# EAGLE design untitled (EAGLE 9.1.1)
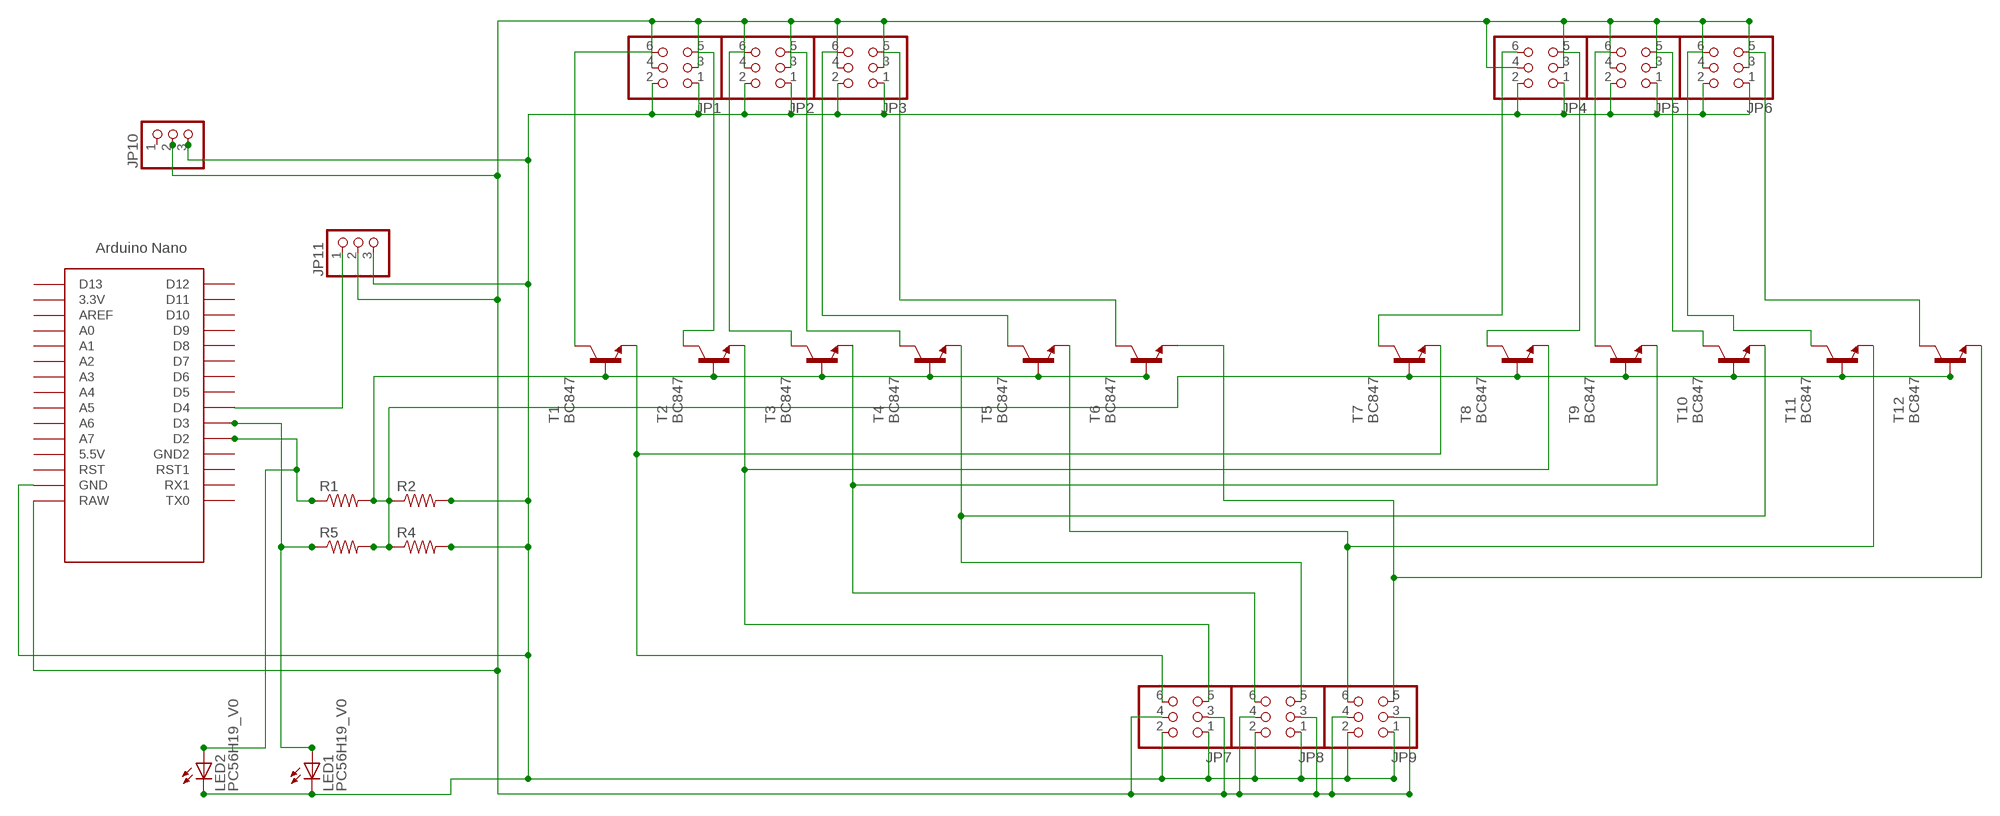
[diagram p0: schematic, sheet 1]

## Parts
JP1  PINHD-2X3  [2X03]
JP2  PINHD-2X3  [2X03]
JP3  PINHD-2X3  [2X03]
JP4  PINHD-2X3  [2X03]
JP5  PINHD-2X3  [2X03]
JP6  PINHD-2X3  [2X03]
JP7  PINHD-2X3  [2X03]
JP8  PINHD-2X3  [2X03]
JP9  PINHD-2X3  [2X03]
JP10  PINHD-1X3  [1X03]
JP11  PINHD-1X3  [1X03]
LED1  PC56H19_V0  [PC56H19_V0]
LED2  PC56H19_V0  [PC56H19_V0]
R1  R-US_0207/10  [0207/10]
R2  R-US_0207/10  [0207/10]
R4  R-US_0207/10  [0207/10]
R5  R-US_0207/10  [0207/10]
T1  BC847  [SOT23]
T2  BC847  [SOT23]
T3  BC847  [SOT23]
T4  BC847  [SOT23]
T5  BC847  [SOT23]
T6  BC847  [SOT23]
T7  BC847  [SOT23]
T8  BC847  [SOT23]
T9  BC847  [SOT23]
T10  BC847  [SOT23]
T11  BC847  [SOT23]
T12  BC847  [SOT23]
U$1  NANO  [NANO]

## Nets
N$1: JP1.6 T1.3(C)
N$2: JP1.5 T2.3(C)
N$3: JP2.6 T3.3(C)
N$4: JP2.5 T4.3(C)
N$5: JP3.6 T5.3(C)
N$6: JP3.5 T6.3(C)
N$7: JP4.6 T7.3(C)
N$8: JP4.5 T8.3(C)
N$9: JP5.6 T9.3(C)
N$10: JP5.5 T10.3(C)
N$11: JP6.6 T11.3(C)
N$12: JP6.5 T12.3(C)
N$13: JP1.1 JP1.2 JP2.1 JP2.2 JP3.1 JP3.2 JP4.1 JP4.2 JP5.1 JP5.2 JP6.1 JP6.2 JP7.1 JP7.2 JP8.1 JP8.2 JP9.1 JP9.2 JP10.3 JP11.3 LED1.1(C) LED1.3(C) LED2.1(C) LED2.3(C) R2.2 R4.2 U$1.GND
N$14: JP11.1 U$1.D4
N$15: LED2.2(A) LED2.4(A) R1.1 U$1.D2
N$16: JP9.6 T5.2(E) T11.2(E)
N$17: JP7.6 T1.2(E) T7.2(E)
N$18: JP7.5 T2.2(E) T8.2(E)
N$19: JP8.6 T3.2(E) T9.2(E)
N$20: JP8.5 T4.2(E) T10.2(E)
N$21: JP9.5 T6.2(E) T12.2(E)
N$22: LED1.2(A) LED1.4(A) R5.1 U$1.D3
N$23: R4.1 R5.2 T7.1(B) T8.1(B) T9.1(B) T10.1(B) T11.1(B) T12.1(B)
N$24: R1.2 R2.1 T1.1(B) T2.1(B) T3.1(B) T4.1(B) T5.1(B) T6.1(B)
N$36: JP1.3 JP1.4 JP2.3 JP2.4 JP3.3 JP3.4 JP4.3 JP4.4 JP5.3 JP5.4 JP6.3 JP6.4 JP7.3 JP7.4 JP8.3 JP8.4 JP9.3 JP9.4 JP10.2 JP11.2 U$1.RAW
Unconnected: JP10.1 U$1.3.3V U$1.5V(5.5V) U$1.A0 U$1.A1 U$1.A2 U$1.A3 U$1.A4 U$1.A5 U$1.A6 U$1.A7 U$1.AREF U$1.D5 U$1.D6 U$1.D7 U$1.D8 U$1.D9 U$1.D10 U$1.D11 U$1.D12 U$1.D13 U$1.GND1(GND2) U$1.ICSP1 U$1.ICSP2 U$1.ICSP3 U$1.ICSP4 U$1.ICSP5 U$1.ICSP6 U$1.RST U$1.RST1 U$1.RX1 U$1.TX0

## Library data of the parts
JP1-JP9 = SparkFun:PINHD-2X3: PIN HEADER
JP10 JP11 = pinhead:PINHD-1X3: PIN HEADER
LED1 LED2 = led:PC56H19_V0: Lextar white SMD LED Source: PC56H19_20150317.pdf www.lextar.com
R1 R2 R4 R5 = rcl:R-US_: RESISTOR, American symbol; SPICEPREFIX: R
T1-T12 = transistor:BC847: NPN TRANSISTOR
U$1 = Arduino-clone:NANO: Arduino Nano

## Board
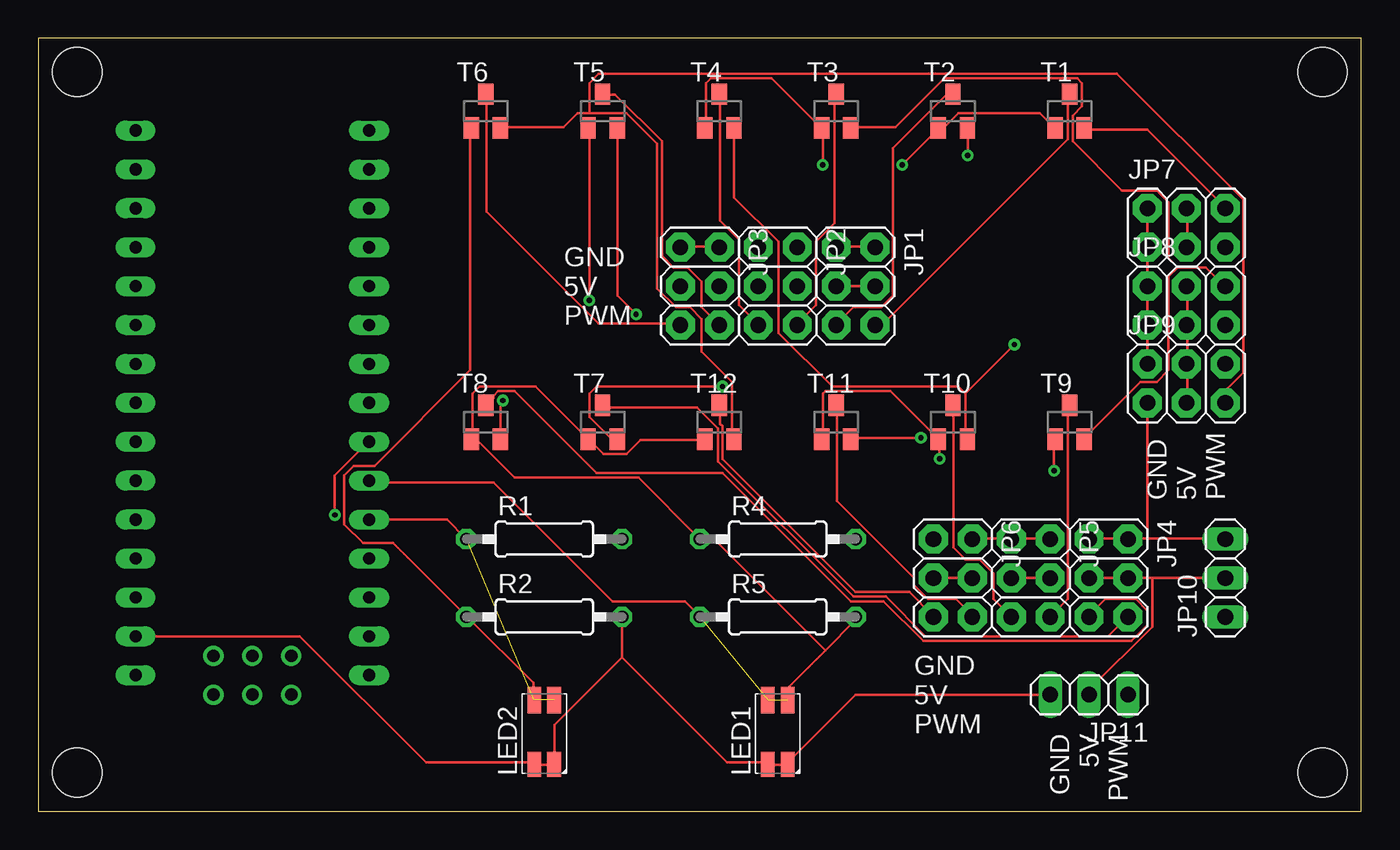
[diagram p1: board, top side]
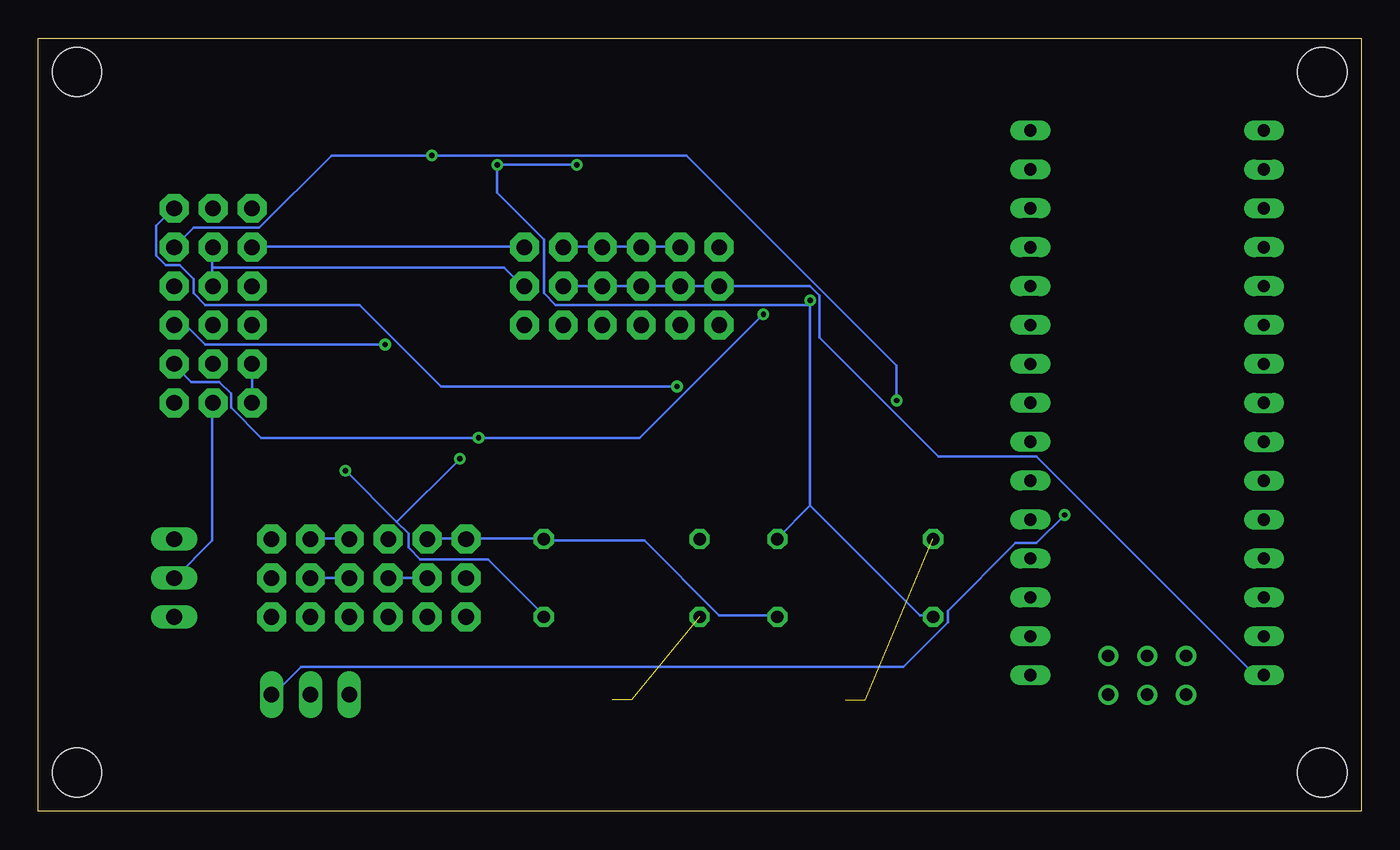
[diagram p2: board, bottom side, seen from below]

Size 86.34 x 50.47 mm. Coordinates in mm from the lower left corner, seen from the top.
Outline: 0,0 86.34,0 86.34,50.47 0,50.47 0,0
Copper layers (1*16): Top 0.035mm / dielectric 1.5mm / Bottom 0.035mm
Design rules "default": minimum track width 6mil, minimum drill 0.35mm, track to track 6mil, track to pad 6mil, pad to pad 6mil, via to via 6mil, smd to smd 6mil, copper to edge 40mil, drill to drill 6mil, minimum pad ring 10mil, minimum via ring 8mil, stop-mask expansion 4mil, vias tented up to drill 0mil, thermal gap 10mil
Holes 3.2 mm at 83.82,48.26 83.82,2.54 2.54,2.54 2.54,48.26

### Footprints (pad centres in the part's own frame; a part is rotated, then mirrored left to right if it is on the bottom)
2X03 = drill 1.016 pad 1.88 octagon: 1 -2.54,-1.27; 2 -2.54,1.27; 3 0,-1.27; 4 0,1.27; 5 2.54,-1.27; 6 2.54,1.27
1X03 = drill 1.016 long: 1 -2.54,0; 2 0,0; 3 2.54,0
PC56H19_V0 = smd 1.63 x 0.9: 1 -2.01,0.65; 3 -2.01,-0.645 | smd 1.73 x 0.9: 2 2.195,0.65; 4 2.195,-0.65
0207/10 = drill 0.813 octagon: 1 -5.08,0; 2 5.08,0
SOT23 = smd 1 x 1.4: 1 -0.95,-1.1; 2 0.95,-1.1; 3 0,1.1
NANO = drill 0.8 long: 3.3V -10.16,24.13; 5V -10.16,-1.27; A0 -10.16,19.05; A1 -10.16,16.51; A2 -10.16,13.97; A3 -10.16,11.43; A4 -10.16,8.89; A5 -10.16,6.35; A6 -10.16,3.81; A7 -10.16,1.27; AREF -10.16,21.59; D2 5.08,1.27; D3 5.08,3.81; D4 5.08,6.35; D5 5.08,8.89; D6 5.08,11.43; D7 5.08,13.97; D8 5.08,16.51; D9 5.08,19.05; D10 5.08,21.59; D11 5.08,24.13; D12 5.08,26.67; D13 -10.16,26.67; GND -10.16,-6.35; GND1 5.08,-1.27; RAW -10.16,-8.89; RST -10.16,-3.81; RST1 5.08,-3.81; RX1 5.08,-6.35; TX0 5.08,-8.89 | drill 0.8: ICSP1 -5.08,-10.16; ICSP2 -5.08,-7.62; ICSP3 -2.54,-10.16; ICSP4 -2.54,-7.62; ICSP5 0,-10.16; ICSP6 0,-7.62

### Placement (x,y rotation side)
JP1  53.34,34.29 270 top
JP2  48.26,34.29 270 top
JP3  43.18,34.29 270 top
JP4  69.85,15.24 270 top
JP5  64.77,15.24 270 top
JP6  59.69,15.24 270 top
JP7  74.93,38.1 0 top
JP8  74.93,33.02 0 top
JP9  74.93,27.94 0 top
JP10  77.47,15.24 90 top
JP11  68.58,7.62 180 top
LED1  48.26,5.08 90 top
LED2  33.02,5.08 90 top
R1  33.02,17.78 0 top
R2  33.02,12.7 0 top
R4  48.26,17.78 0 top
R5  48.26,12.7 0 top
T1  67.31,45.72 0 top
T2  59.69,45.72 0 top
T3  52.07,45.72 0 top
T4  44.45,45.72 0 top
T5  36.83,45.72 0 top
T6  29.21,45.72 0 top
T7  36.83,25.4 0 top
T8  29.21,25.4 0 top
T9  67.31,25.4 0 top
T10  59.69,25.4 0 top
T11  52.07,25.4 0 top
T12  44.45,25.4 0 top
U$1  16.51,17.78 0 top

### Tracks (layer width: path | path; a pad name or v marks a point on that pad's centre or on a via)
N$1
  Top 0.152: T1.3 67.21,46.79 67.21,43.89 55.17,31.85 54.71,31.85 JP1.6
N$2
  Top 0.152: T2.3 59.59,46.79 59.28,46.79 55.78,43.28 55.78,33.68 55.02,32.92 53.19,32.92 52.12,31.85 JP1.5
N$3
  Top 0.152: T3.3 51.97,46.79 51.97,38.41 50.75,37.19 50.75,33.07 49.53,31.85 JP2.6
N$4
  Top 0.152: T4.3 44.5,46.79 44.5,38.56 45.72,37.34 45.72,33.07 46.94,31.85 JP2.5
N$5
  Top 0.152: T5.3 36.88,46.79 37.64,46.79 40.69,43.74 40.69,36.27 41.45,35.51 42.37,35.51 43.28,34.59 43.28,32.92 44.35,31.85 JP3.6
N$6
  Top 0.152: T6.3 29.26,46.79 29.26,39.17 36.58,31.85 41.91,31.85 JP3.5
N$7
  Top 0.152: T7.3 36.88,26.36 42.98,26.36 44.35,24.99 44.35,22.86 53.19,14.02 55.32,14.02 57.91,11.43 69.8,11.43 71.02,12.65 JP4.6
N$8
  Top 0.152: T8.3 29.26,26.52 29.72,26.98 29.72,27.13 30.02,27.43 31.09,27.43 36.42,22.1 44.65,22.1 53.03,13.72 55.17,13.72 57.76,11.12 71.32,11.12 72.39,12.19 72.39,13.11 71.63,13.87 69.65,13.87 68.58,12.8 JP4.5
N$9
  Top 0.152: T9.3 67.21,26.36 67.21,13.87 66.14,12.8 JP5.6
N$10
  Top 0.152: T10.3 59.74,26.36 59.74,17.22 60.5,16.46 61.42,16.46 62.33,15.54 62.33,13.87 63.4,12.8 JP5.5
N$11
  Top 0.152: T11.3 52.12,26.36 52.12,20.27 57.15,15.24 57.15,14.78 58.06,13.87 59.89,13.87 60.96,12.8 JP6.6
N$12
  Top 0.152: T12.3 44.5,26.36 44.5,25.3 44.65,25.15 44.65,23.01 53.34,14.33 56.84,14.33 58.37,12.8 JP6.5
N$13
  Top 0.152: 38.1,10.06 33.68,5.64 33.68,3.2 LED2.3 33.53,3.05 32.46,3.05 LED2.1 32.31,3.2 25.3,3.2 17.07,11.43 6.4,11.43 U$1.GND | 38.1,10.06 38.1,12.65 R2.2 | 38.1,10.06 44.96,3.2 47.55,3.2 LED1.1 47.7,3.05 48.77,3.05 LED1.3 48.92,3.2 53.34,7.62 65.99,7.62 JP11.3 | JP1.1 52.12,36.88 54.56,36.88 JP1.2 | JP3.1 41.91,36.88 44.35,36.88 JP3.2 | JP9.2 72.39,29.26 72.39,31.7 JP8.1 72.39,31.85 JP8.2 72.39,36.73 JP7.1 72.39,36.88 72.39,39.32 JP7.2 | 72.39,17.83 71.17,17.83 JP4.2 71.02,17.83 68.58,17.83 JP4.1 | 72.39,17.83 77.42,17.83 JP10.3 | JP6.2 60.96,17.83 63.4,17.83 JP5.1 63.55,17.83 65.99,17.83 JP5.2 | 72.39,17.83 JP9.1
  Bottom 0.152: 49.53,36.88 47.09,36.88 JP2.1 46.94,36.88 44.5,36.88 JP3.2 | 49.53,36.88 JP2.2 49.53,36.88 | 49.53,36.88 51.97,36.88 JP1.1 | JP9.1 72.39,29.11 JP9.2 | JP5.2 66.14,17.83 68.58,17.83 JP4.1 | JP6.2 60.96,17.83 58.52,17.83 JP6.1 58.37,17.83 53.34,17.83 R4.2 53.34,17.68 46.79,17.68 41.91,12.8 38.1,12.8 R2.2 | JP1.2 54.71,36.88 72.39,36.88 JP7.1
N$14  (via drill 0.35)
  Top 0.152: v19.36,19.36 19.36,21.95 21.49,24.08 U$1.D4
  Bottom 0.152: v19.36,19.36 21.18,17.53 22.55,17.53 26.98,13.11 26.98,12.34 29.87,9.45 69.19,9.45 71.02,7.62 JP11.1
N$15  (2 unrouted)
  Top 0.152: U$1.D2 21.64,19.05 26.67,19.05 27.89,17.83 R1.1
N$16  (via drill 0.35)
  Top 0.152: v57.61,24.38 53.03,24.38 T11.2 | v39.01,32.46 37.8,33.68 37.8,44.5 T5.2
  Bottom 0.152: JP9.6 77.42,29.11 76.35,28.04 74.52,28.04 73.76,27.28 73.76,26.36 71.78,24.38 v57.61,24.38 47.09,24.38 v39.01,32.46
N$17  (via drill 0.35)
  Top 0.152: v44.65,27.74 36.42,27.74 35.97,27.28 35.97,25.76 37.34,24.38 37.64,24.38 T7.2 | T1.2 68.28,44.5 72.39,44.5 77.42,39.47 JP7.6
  Bottom 0.152: v44.65,27.74 60.05,27.74 65.38,33.07 75.44,33.07 76.2,33.83 76.2,34.75 77.11,35.66 78.03,35.66 78.64,36.27 78.64,38.25 77.57,39.32 JP7.6
N$18  (via drill 0.35)
  Top 0.152: v30.33,26.82 30.18,26.67 30.18,24.38 T8.2 | v60.66,42.82 60.66,44.5 T2.2
  Bottom 0.152: v30.33,26.82 30.33,29.11 44.04,42.82 v60.66,42.82 67.21,42.82 71.93,38.1 76.2,38.1 77.42,36.88 JP7.5
N$19
  Top 0.152: 74.37,35.51 73.76,34.9 73.76,28.8 73,28.04 71.93,28.04 68.28,24.38 T9.2 | 74.37,35.51 76.2,35.51 77.42,34.29 JP8.6 | 74.37,35.51 73.76,36.12 73.76,39.78 73,40.54 70.71,40.54 67.51,43.74 67.51,45.41 68.12,46.02 68.12,47.55 67.82,47.85 59.13,47.85 55.93,44.65 53.03,44.65 T3.2
N$20  (via drill 0.35)
  Top 0.152: 60.5,27.28 60.05,27.74 51.82,27.74 48.31,31.24 48.31,37.19 45.41,40.08 45.41,44.5 T4.2 | 60.5,27.28 60.5,24.38 T10.2 | 60.5,27.28 v63.7,30.48
  Bottom 0.152: v63.7,30.48 75.44,30.48 76.66,31.7 77.42,31.7 JP8.5
N$21
  Top 0.152: 35.97,45.57 38.41,45.57 40.39,43.59 40.39,34.14 41.6,32.92 42.52,32.92 43.28,32.16 43.28,30.02 45.26,28.04 45.26,24.38 T12.2 | 35.97,45.57 35.2,45.57 34.29,44.65 30.18,44.65 T6.2 | 35.97,45.57 35.97,47.55 36.58,48.16 70.41,48.16 78.64,39.93 78.64,28.65 77.57,27.58 77.57,26.67 JP9.5
N$22  (2 unrouted)
  Top 0.152: U$1.D3 21.64,21.49 29.72,21.49 37.49,13.72 42.22,13.72 43.13,12.8 R5.1
N$23  (via drill 0.35)
  Top 0.152: T12.1 43.43,24.23 39.32,24.23 38.41,23.32 36.88,23.32 35.97,24.23 T7.1 35.81,24.38 32.46,27.74 28.8,27.74 28.35,27.28 28.35,24.38 T8.1 28.35,24.23 28.65,24.23 31.09,21.79 39.17,21.79 43.13,17.83 R4.1 43.28,17.68 44.2,17.68 51.36,10.52 | T11.1 51.21,24.38 51.21,27.28 51.36,27.43 55.63,27.43 58.67,24.38 T10.1 58.83,24.23 v58.83,23.01 | v66.29,22.25 66.29,24.23 T9.1 | 48.92,7.32 48.92,8.08 51.36,10.52 | 51.36,10.52 53.34,12.5 53.34,12.65 R5.2
  Bottom 0.152: 62.94,18.9 62.18,18.14 62.18,17.22 61.42,16.46 57,16.46 53.34,12.8 R5.2 | 62.94,18.9 v66.29,22.25 | 62.94,18.9 v58.83,23.01
N$24  (via drill 0.35)
  Top 0.152: T6.1 28.19,44.5 28.19,28.8 21.95,22.55 20.57,22.55 19.96,21.95 19.96,18.75 21.18,17.53 23.16,17.53 27.89,12.8 R2.1 28.04,12.65 32.31,8.38 32.31,7.32 | T4.1 43.59,44.65 43.59,47.55 43.89,47.85 47.85,47.85 51.05,44.65 T3.1 51.21,44.5 v51.21,42.22 | T1.1 66.29,44.65 65.38,45.57 60.05,45.57 59.13,44.65 58.83,44.65 T2.1 58.67,44.5 v56.39,42.22 | v35.97,33.38 35.97,44.5 T5.1
  Bottom 0.152: 35.97,19.96 35.97,33.07 | 35.97,33.07 v35.97,33.38 35.97,33.07 | 35.97,19.96 38.1,17.83 R1.2 | 35.97,33.07 52.58,33.07 53.34,33.83 53.34,37.34 56.39,40.39 v56.39,42.22 v51.21,42.22 | 35.97,19.96 28.8,12.8 28.04,12.8 R2.1
N$36
  Top 0.152: JP7.3 74.98,36.88 74.98,39.32 JP7.4 | JP9.3 74.98,26.67 74.98,29.11 JP9.4 74.98,29.26 74.98,31.7 JP8.3 74.98,31.85 74.98,34.29 JP8.4 | JP6.4 58.52,15.24 JP6.3 | JP5.3 63.55,15.24 65.99,15.24 JP5.4 | 72.69,15.24 71.17,15.24 JP4.4 71.02,15.24 JP4.3 | 72.69,15.24 77.42,15.24 JP10.2 | JP1.3 52.12,34.29 54.56,34.29 JP1.4 | JP11.2 68.58,7.92 72.69,12.04 72.69,15.24
  Bottom 0.152: 74.98,35.51 74.98,34.29 JP8.4 | 74.98,35.51 74.98,36.73 JP7.3 | JP6.4 63.4,15.24 JP5.3 | JP4.3 66.14,15.24 JP5.4 | JP9.3 74.98,26.67 74.98,17.68 77.42,15.24 JP10.2 | JP1.3 51.97,34.29 JP2.4 47.09,34.29 JP2.3 46.94,34.29 44.5,34.29 JP3.4 44.35,34.29 JP3.3 35.97,34.29 35.36,33.68 35.36,30.94 27.58,23.16 21.18,23.16 7.01,8.99 6.4,8.99 U$1.RAW | 74.98,35.51 55.93,35.51 54.71,34.29 JP1.4

### Text on the board
tPlace: GND / 5V / PWM | GND / 5V / PWM | GND / 5V / PWM | GND / 5V / PWM
Document: output | 10k | 7k | GND / 5V | 7k | 10k | Power | Input